# Altium schematic sheet GateDriverPowerSupply.SchDoc: Isolated power supply
size A4; Date: Power Conditioning Laboratory; CheckedBy: Hildo / Joel; Author: Fellipe / Arthur; Organization: UNICAMP / LCEE; Address1: University of Campinas - Brazil; Address2: Power Conditioning Laboratory; Address3: Licensed by GNU GPL 3.0; CurrentTime: University of Campinas - Brazil; DocumentFullPathAndName: Licensed by GNU GPL 3.0; ProjectName: Easy Inverter
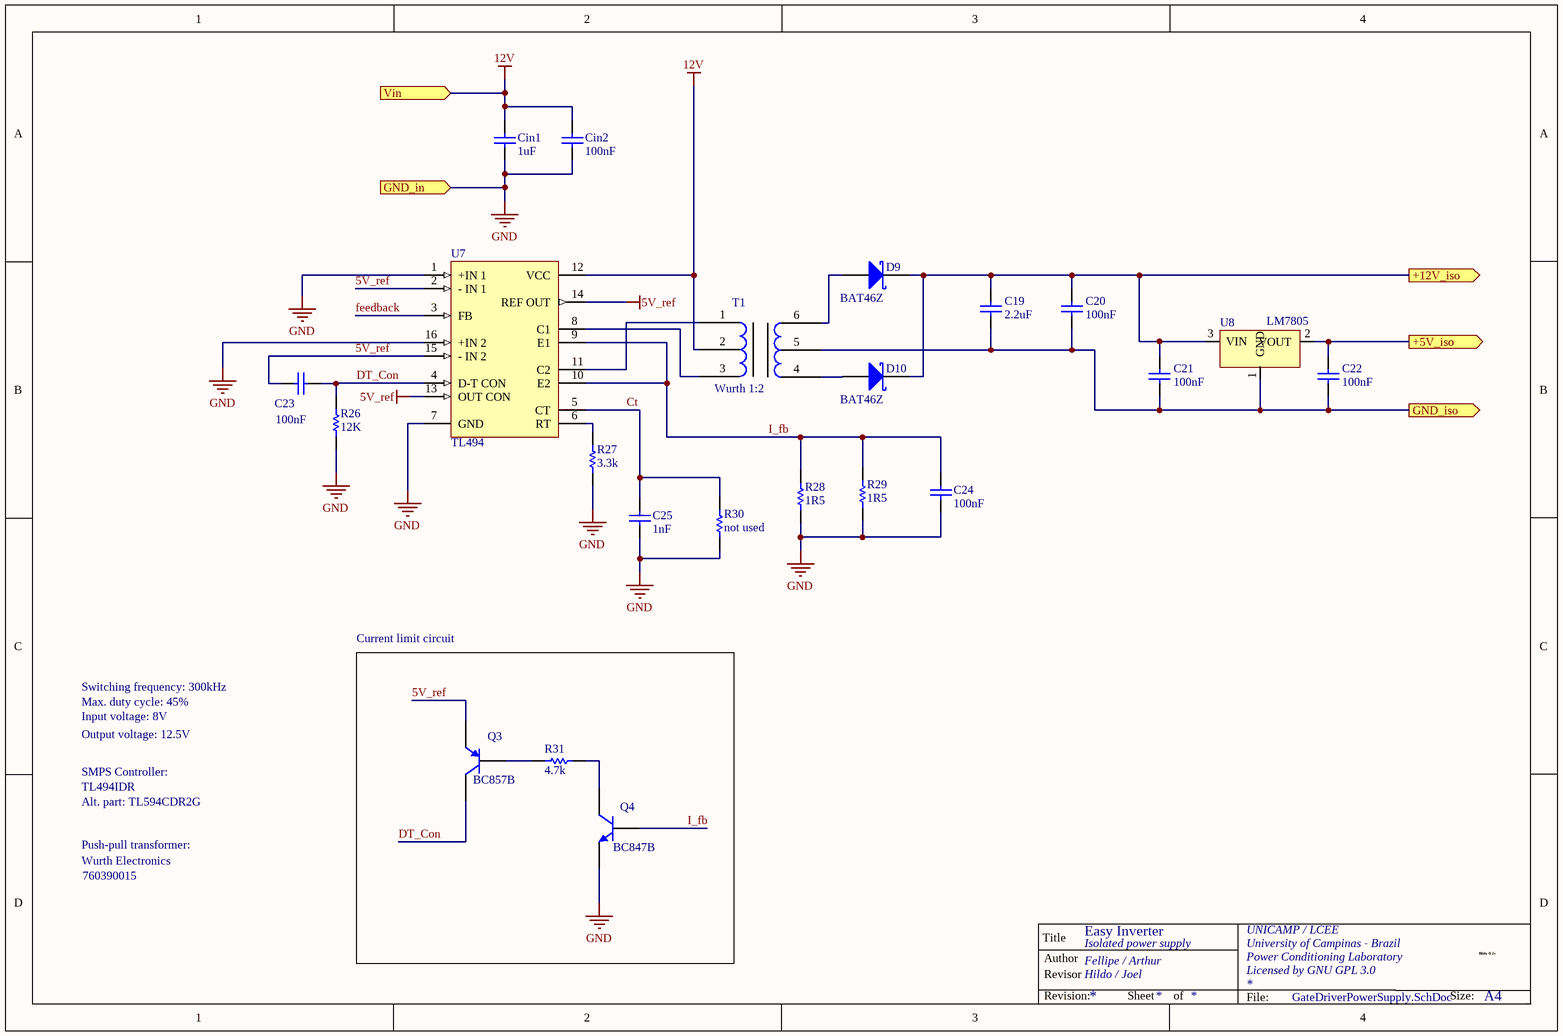
[diagram p0: GateDriverPowerSupply.SchDoc]

## Parts
C19  value 2.2uF  [0805_W]
C20  value 100nF  [0805_W]
C21  value 100nF  [0805_W]
C22  value 100nF  [0805_W]
C23  value 100nF  [0805_W]
C24  value 100nF  [0805_W]
C25  value 1nF  [0805_W]
Cin1  value 1uF  [0805_W]
Cin2  value 100nF  [0805_W]
D9  value BAT46Z  [SOD-123]
D10  value BAT46Z  [SOD-123]
Q3  value BC857B  [SOT-23-TT3_N]
Q4  value BC847B  [SOT-23-TT3_N]
R26  value 12K  [0805_W]
R27  value 3.3k  [0805_W]
R28  value 1R5  [0805_W]
R29  value 1R5  [0805_W]
R30  value not used  [0805_W]
R31  value 4.7k  [0805_W]
T1  value Wurth 1:2  [Trafo]
U7  value TL494  [SOIC16_M]
U8  value LM7805  [LM78XX]

## Blocks framed on the sheet
Current limit circuit: Q3 Q4 R31

## Ports
+5V_iso (out), +12V_iso (out), GND_in (in), GND_iso (out), Vin (in)

## Nets
5V_ref: C23.1 Q3.2(E) U7.2(-_IN_1) U7.13(OUT_CON) U7.14(REF_OUT) U7.15(-_IN_2)
12V: Cin1.1 Cin2.1 T1.2 U7.12(VCC) ; port Vin
GND: C24.1 C25.2 Cin1.2 Cin2.2 Q4.2(E) R26.1 R27.1 R28.1 R29.1 R30.1 U7.1(+IN_1) U7.7(GND) U7.16(+IN_2) ; port GND_in
+5V_iso: C22.1 U8.2(VOUT) ; port +5V_iso
+12V_iso: C19.1 C20.1 C21.1 D9.2(K) D10.2(K) U8.3(VIN) ; port +12V_iso
Ct: C25.1 R30.2 U7.5(CT)
DT_Con: C23.2 Q3.3(C) R26.2 U7.4(D-T_CON)
feedback: U7.3(FB)
GND_iso: C19.2 C20.2 C21.2 C22.2 T1.5 U8.1(GND) ; port GND_iso
I_fb: C24.2 Q4.1(B) R28.2 R29.2 U7.9(E1) U7.10(E2)
NetD9_1: D9.1(A) T1.6
NetD10_1: D10.1(A) T1.4
NetQ3_1: Q3.1(B) R31.2
NetQ4_3: Q4.3(C) R31.1
NetR27_2: R27.2 U7.6(RT)
NetT1_1: T1.1 U7.11(C2)
NetT1_3: T1.3 U7.8(C1)

## Notes on the sheet
- Switching frequency: 300kHz
- Max. duty cycle: 45%
- Input voltage: 8V
- SMPS Controller:
- TL494IDR
- Output voltage: 12.5V
- Alt. part: TL594CDR2G
- Push-pull transformer:
- Wurth Electronics
- 760390015
- Title
- Author
- Revisor
- Hildo G Jr
- Revision:
- Sheet
- of
- File:
- Size:
- A4
- HGJr

## Library data of the parts
C19 = Capacitor_nao_polarizado: Capacitor nao polarizado; pn: 08053C225KAT2A
C20-C22 = Capacitor_nao_polarizado: Capacitor nao polarizado; pn: 08053C104KAT2A
C23 C24 Cin2 = Cap_0805: Capacitor; pn: 08053C104KAT2A
C25 = Cap_0805: Capacitor; pn: 08053C102KAT2A
Cin1 = Cap_0805: Capacitor; pn: 08053C105KAT2A
D9 D10 = D Schottky: Schottky Diode; pn: BAT46ZFILM
Q3 = BC857: PNP General-purpose Transistor; pn: BC857BLT1G
Q4 = BC847: NPN General-purpose Transistor; pn: BC847BLT1G
R26 = Res_0805: Resistor; pn: RMCF0805JT12K0
R27 = Res_0805: Resistor; pn: RMCF0805JT3K30
R28 R29 = Res_0805: Resistor; pn: RMCF0805JT1R50
R30 = Res_0805: Resistor; Manufacturer: Generic Components; Class: Passive; Published: 08/06/2000; Publisher: Altium Hobart Technology Centre; SubClass: Resistor
R31 = Res_0805: Resistor; pn: RMCF0805JT4K70
T1 = Trafo-TI: pn: 760390015
U7 = TL494ID: Pulse-Width-Modulation Control Circuit; pn: TL494IDR
U8 = LM7805: pn: UA78M05CDCY